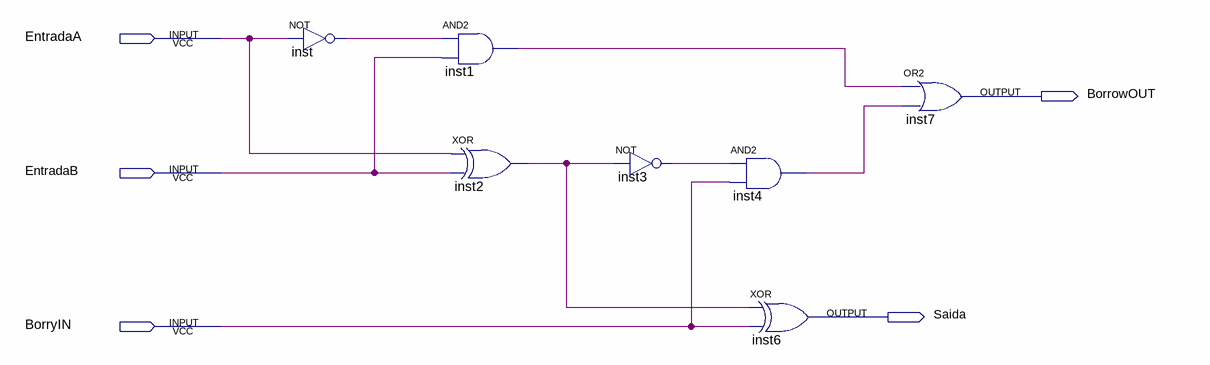
[diagram p0: schematic sheet]
// Quartus schematic SubSerie.bdf as structural Verilog: 7 symbols, 5 pins
module SubSerie (
  input  EntradaA,
  input  EntradaB,
  input  BorryIN,
  output BorrowOUT,
  output Saida
);

  wire inst1_out, inst2_out, inst3_out, inst4_out, inst_out;

  not inst (inst_out, EntradaA);
  and inst1 (inst1_out, inst_out, EntradaB);
  xor inst2 (inst2_out, EntradaA, EntradaB);
  not inst3 (inst3_out, inst2_out);
  and inst4 (inst4_out, inst3_out, BorryIN);
  xor inst6 (Saida, inst2_out, BorryIN);
  or inst7 (BorrowOUT, inst1_out, inst4_out);
endmodule
